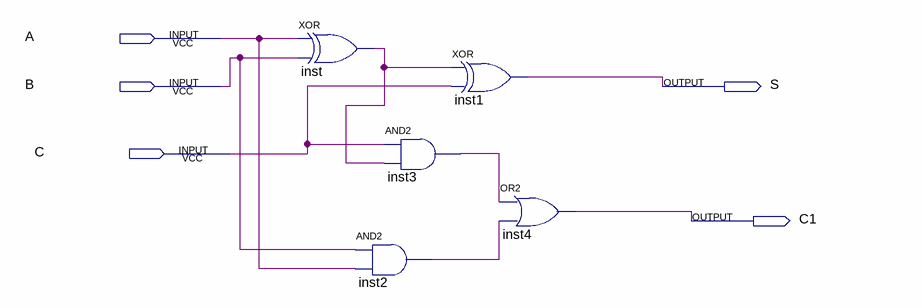
[diagram p0: schematic sheet]
// Quartus schematic FullAdder.bdf as structural Verilog: 5 symbols, 5 pins
module FullAdder (
  input  A,
  input  B,
  input  C,
  output S,
  output C1
);

  wire inst2_out, inst3_out, inst_out;

  xor inst (inst_out, A, B);
  and inst2 (inst2_out, B, A);
  and inst3 (inst3_out, C, inst_out);
  xor inst1 (S, inst_out, C);
  or inst4 (C1, inst3_out, inst2_out);
endmodule
